# EAGLE design watch030818 (EAGLE 8.3.1)
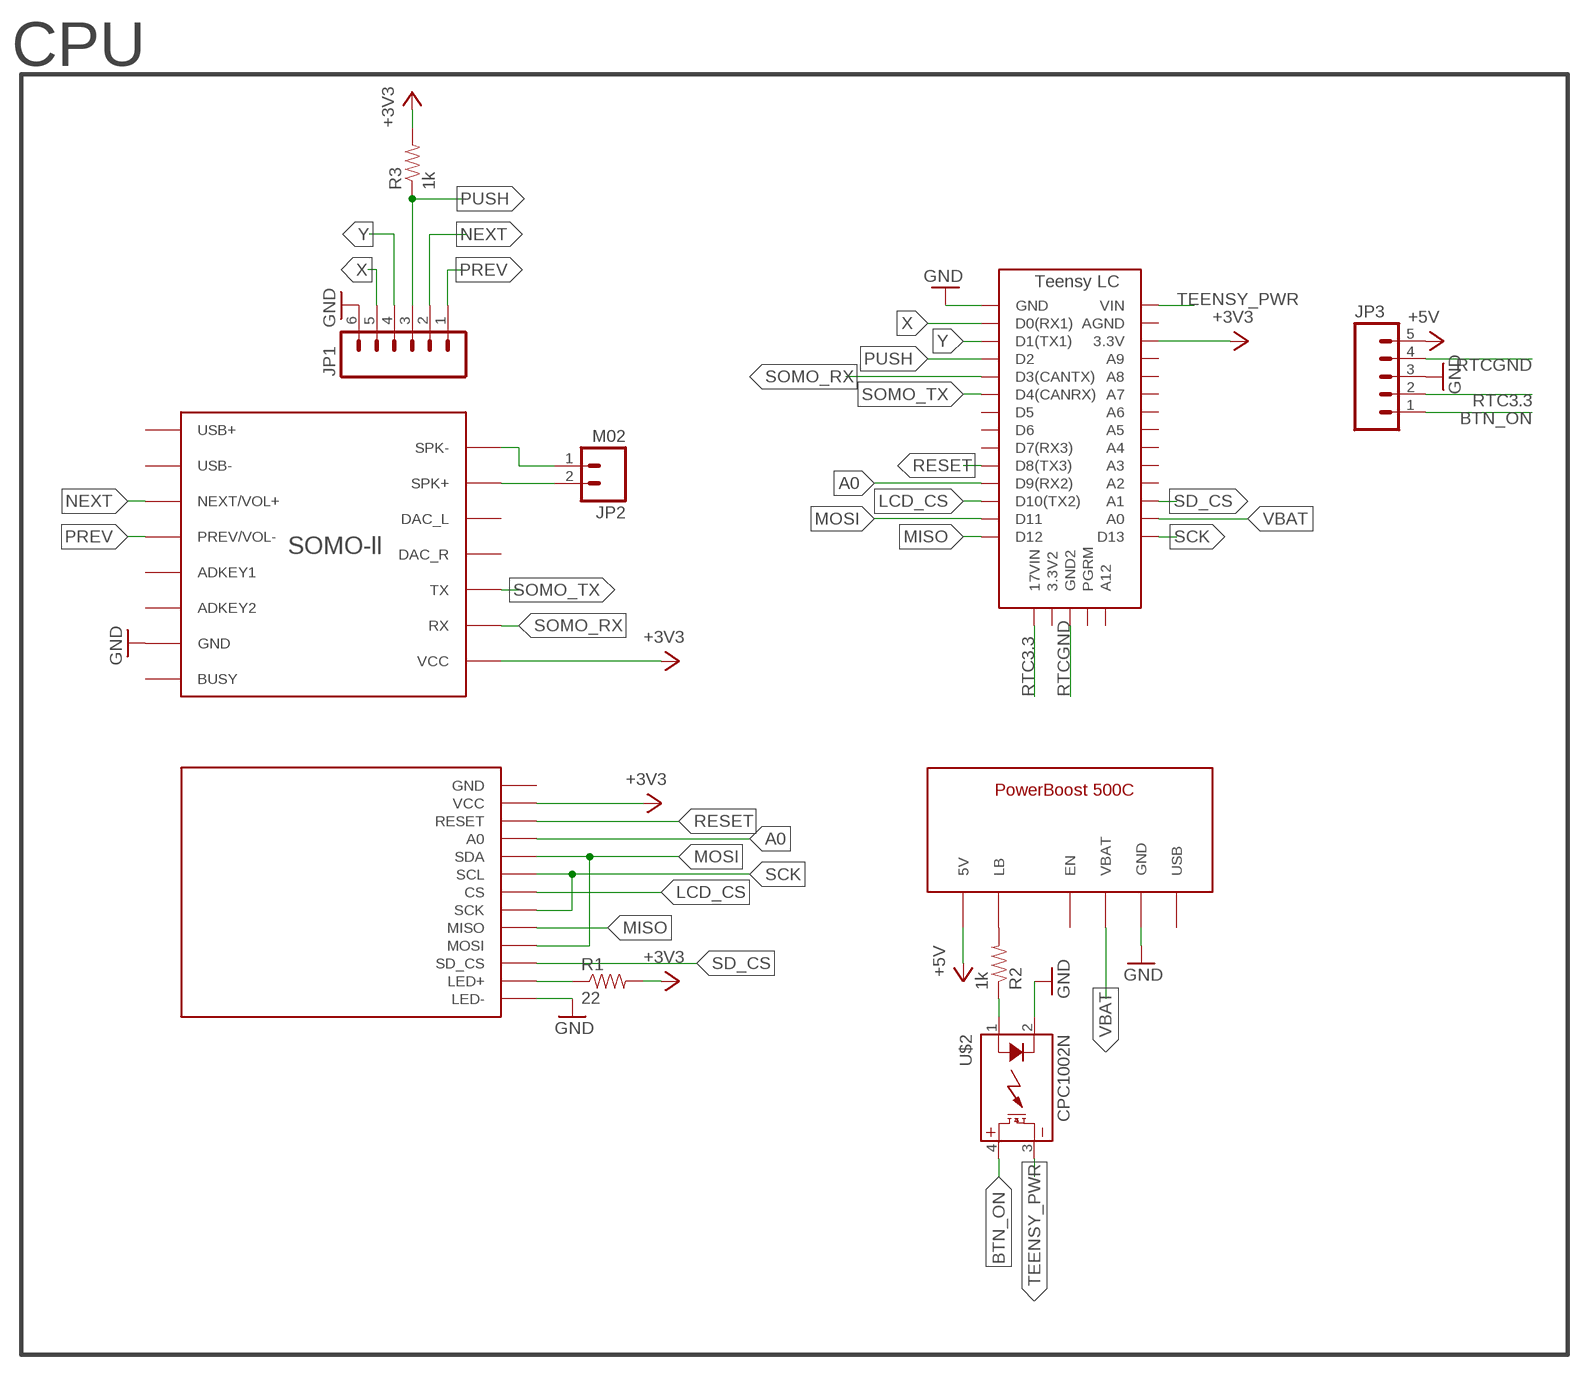
[diagram p0: schematic, sheet 1]

## Parts
1.8-SPI-TFT  KMR-1.8_SPI_TFT  [KMR-1.8_SPI_TFT]
JP1  M06  [1X06]
JP2  M02  [1X02]
JP3  M05  [1X05]
R1  22  RESISTOR0402  [0402-RES]
R2  1k  RESISTOR0402  [0402-RES]
R3  1k  RESISTOR0402  [0402-RES]
U$1  TEENSY_LC  [TEENSY_LC]
U$2  CPC1002N  [SOP04]
U$5  POWERBOOST-500C  [POWERBOOST-500C]
U$11  SOMO-LL  [SOMO-LL]

## Nets
+3V3: 1.8-SPI-TFT.VCC R1.2 R3.2 U$1.3.3V U$11.VCC
+5V: JP3.5 U$5.5V
A0: 1.8-SPI-TFT.A0 U$1.D9(RX2)
BTN_ON: JP3.1 U$2.4(DC+)
GND: 1.8-SPI-TFT.LED- JP1.6 JP3.3 U$1.GND U$2.2(CONTROL-) U$5.GND0(GND) U$5.GND1(GND) U$5.GND2(GND) U$11.GND U$11.GND@0(GND)
LB: R2.2 U$5.LB
LCD_CS: 1.8-SPI-TFT.CS U$1.D10(TX2)
MISO: 1.8-SPI-TFT.MISO U$1.D12
MOSI: 1.8-SPI-TFT.MOSI 1.8-SPI-TFT.SDA U$1.D11
N$1: 1.8-SPI-TFT.LED+ R1.1
N$3: R2.1 U$2.1(CONTROL+)
NEXT: JP1.2 U$11.NEXT/VOL+
PREV: JP1.1 U$11.PREV/VOL-
PUSH: JP1.3 R3.1 U$1.D2
RESET: 1.8-SPI-TFT.RESET U$1.D8(TX3)
RTC3.3: JP3.2 U$1.17VIN
RTCGND: JP3.4 U$1.GND2
SCK: 1.8-SPI-TFT.SCK 1.8-SPI-TFT.SCL U$1.D13
SD_CS: 1.8-SPI-TFT.SD_CS U$1.A1
SOMO_RX: U$1.D3(CANTX) U$11.RX
SOMO_TX: U$1.D4(CANRX) U$11.TX
SPK_IN: JP2.1 U$11.SPK-
SPK_OUT: JP2.2 U$11.SPK+
TEENSY_PWR: U$1.VIN U$2.3(DC-)
VBAT: U$1.A0 U$5.VBAT
X: JP1.5 U$1.D0(RX1)
Y: JP1.4 U$1.D1(TX1)
Unconnected: 1.8-SPI-TFT.GND U$1.3.3V2 U$1.A2 U$1.A3 U$1.A4 U$1.A5 U$1.A6 U$1.A7 U$1.A8 U$1.A9 U$1.A12 U$1.AGND U$1.D5 U$1.D6 U$1.D7(RX3) U$1.PGRM U$5.EN U$5.USB U$11.ADKEY1 U$11.ADKEY2 U$11.BUSY U$11.DAC_L U$11.DAC_R U$11.USB+ U$11.USB-

## Notes on the sheet
- CPU

## Library data of the parts
1.8-SPI-TFT = CH:KMR-1.8_SPI_TFT
JP1 = HyTechDevices:M06: Standard 6-pin 0.1" header. NOTES ON THE VARIANTS LOCK and LOCK_LONGPADS... This footprint was designed to help hold the alignment of a through-hole component (i.e. 6-pin header) while soldering it into place. You may notice that each hole has been shifted either up or down by 0.005 of an inch from it's more standard position (which is a perfectly straight line). This slight alteration caused the pins (the squares in the middle) to touch the edges of the holes. Because they are alternating, it causes a "brace" to hold the component in place. 0.005 has proven to be the perfect amount of "off-center" position when using our standard breakaway headers. Although looks a little odd when you look at the bare footprint, once you have a header in there, the alteration is very hard to notice. Also,if you push a header all the way into place, it is covered up entirely on the bottom side. This idea of altering the position of holes to aid alignment will be further integrated into the Sparkfun Library for other footprints. It can help hold any component with 3 or more connection pins. Note: The Sparkfun version includes many other packages including surface mount that may be of future interest. Source: Sparkfun <https://github.com/sparkfun/SparkFun-Eagle-Libraries>
JP2 = HyTechDevices:M02: Standard 2-pin 0.1" header. NOTES ON THE VARIANTS LOCK and LOCK_LONGPADS... This footprint was designed to help hold the alignment of a through-hole component (i.e. 6-pin header) while soldering it into place. You may notice that each hole has been shifted either up or down by 0.005 of an inch from it's more standard position (which is a perfectly straight line). This slight alteration caused the pins (the squares in the middle) to touch the edges of the holes. Because they are alternating, it causes a "brace" to hold the component in place. 0.005 has proven to be the perfect amount of "off-center" position when using our standard breakaway headers. Although looks a little odd when you look at the bare footprint, once you have a header in there, the alteration is very hard to notice. Also,if you push a header all the way into place, it is covered up entirely on the bottom side. This idea of altering the position of holes to aid alignment will be further integrated into the Sparkfun Library for other footprints. It can help hold any component with 3 or more connection pins. Note: The Sparkfun version includes many other packages including surface mount that may be of future interest. Source: Sparkfun <https://github.com/sparkfun/SparkFun-Eagle-Libraries>
JP3 = HyTechDevices:M05: Standard 5-pin 0.1" header. NOTES ON THE VARIANTS LOCK and LOCK_LONGPADS... This footprint was designed to help hold the alignment of a through-hole component (i.e. 5-pin header) while soldering it into place. You may notice that each hole has been shifted either up or down by 0.005 of an inch from it's more standard position (which is a perfectly straight line). This slight alteration caused the pins (the squares in the middle) to touch the edges of the holes. Because they are alternating, it causes a "brace" to hold the component in place. 0.005 has proven to be the perfect amount of "off-center" position when using our standard breakaway headers. Although looks a little odd when you look at the bare footprint, once you have a header in there, the alteration is very hard to notice. Also,if you push a header all the way into place, it is covered up entirely on the bottom side. This idea of altering the position of holes to aid alignment will be further integrated into the Sparkfun Library for other footprints. It can help hold any component with 3 or more connection pins. Note: The Sparkfun version includes many other packages including surface mount that may be of future interest. Source: Sparkfun <https://github.com/sparkfun/SparkFun-Eagle-Libraries>
R1-R3 = HyTechDevices:RESISTOR: Resistor Basic schematic elements and footprints for 0603, 1206, and PTH resistors.
U$1 = HyTechDevices:TEENSY_LC: Version of the Teensy LC board that uses the 2 main rows of pins and the pins opposite the usb port.
U$2 = HyTechDevices:CPC1002N: IXYS Solid State Relay .7A
U$5 = CH:POWERBOOST-500C
U$11 = CH:SOMO-LL

## Board
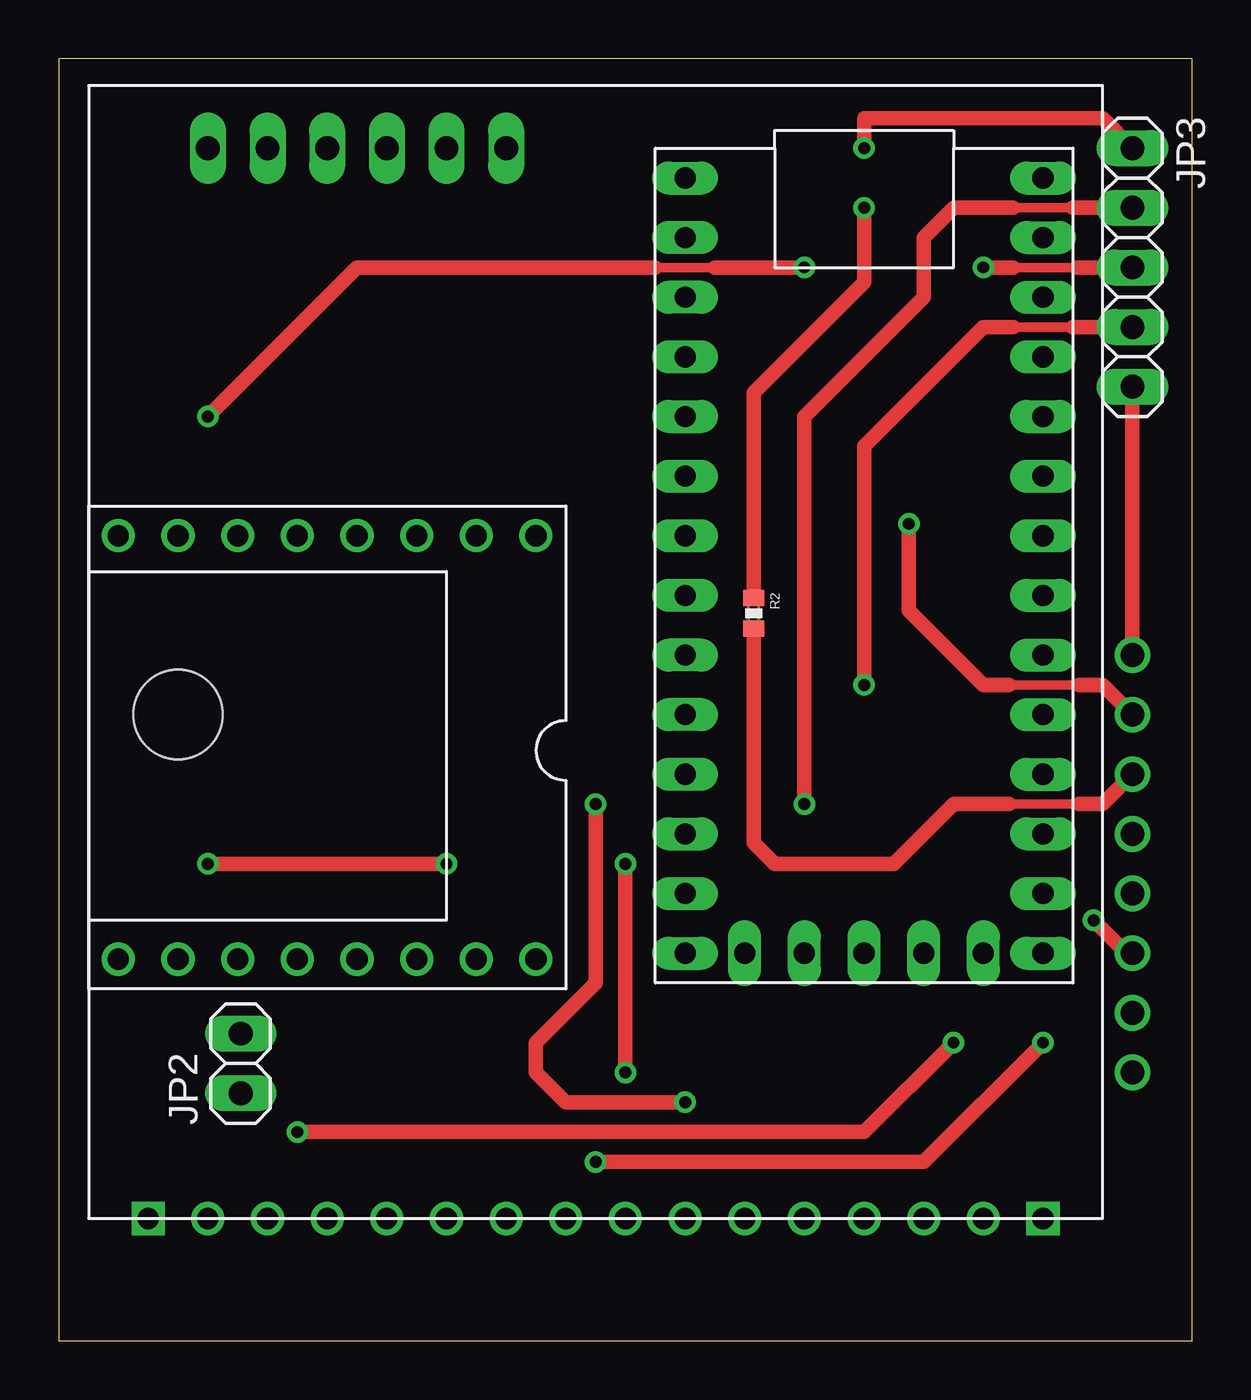
[diagram p1: board, top side]
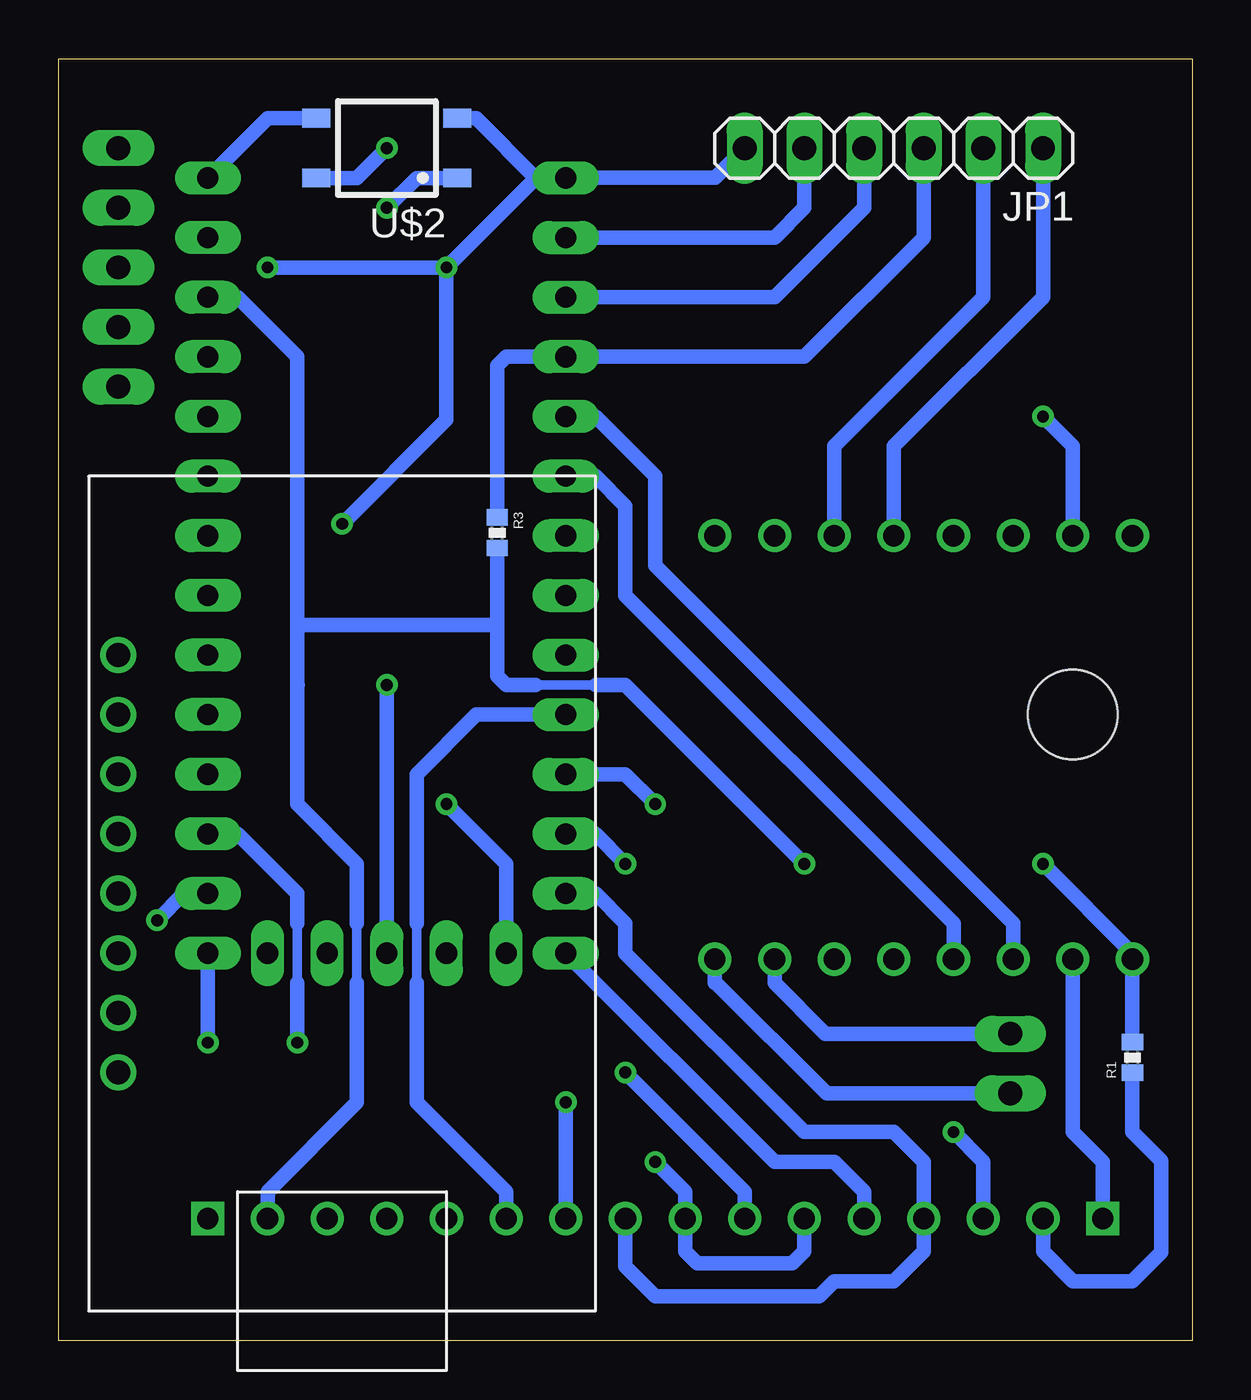
[diagram p2: board, bottom side, seen from below]

Size 48.26 x 54.61 mm. Coordinates in mm from the lower left corner, seen from the top.
Outline: 48.26,0 48.26,54.61 0,54.61 0,0 48.26,0
Copper layers (1*16): Top 0.035mm / dielectric 1.5mm / Bottom 0.035mm
Design rules "DRC Advanced Circuits": minimum track width 6mil, minimum drill 15mil, track to track 6mil, track to pad 6mil, pad to pad 6mil, via to via 6mil, smd to smd 6mil, copper to edge 40mil, drill to drill 6mil, minimum pad ring 10mil, minimum via ring 8mil, stop-mask expansion 4mil, vias tented up to drill 0mil, thermal gap 10mil
Holes 3.81 mm at 5.08,26.67

### Footprints (pad centres in the part's own frame; a part is rotated, then mirrored left to right if it is on the bottom)
KMR-1.8_SPI_TFT = drill 0.9: A0 22.86,0; CS 15.24,0; LED+ 2.54,0; MISO 10.16,0; MOSI 7.62,0; NC1 27.94,0; NC2 30.48,0; NC3 33.02,0; RESET 25.4,0; SCK 12.7,0; SCL 17.78,0; SD_CS 5.08,0; SDA 20.32,0; VCC 35.56,0 | drill 0.9 square: GND 38.1,0; LED- 0,0
1X06 = drill 1.016 long: 1 -6.35,0; 2 -3.81,0; 3 -1.27,0; 4 1.27,0; 5 3.81,0; 6 6.35,0
1X02 = drill 1.016 long: 1 -1.27,0; 2 1.27,0
1X05 = drill 1.016 long: 1 -5.08,0; 2 -2.54,0; 3 0,0; 4 2.54,0; 5 5.08,0
0402-RES = smd 0.7 x 0.9: 1 -0.65,0; 2 0.65,0
TEENSY_LC = drill 0.9 long: 3.3V 16.51,29.21; 3.3V2 6.35,1.27; 17VIN 3.81,1.27; A0 16.51,3.81; A1 16.51,6.35; A2 16.51,8.89; A3 16.51,11.43; A4 16.51,13.97; A5 16.51,16.51; A6 16.51,19.05; A7 16.51,21.59; A8 16.51,24.13; A9 16.51,26.67; A12 13.97,1.27; AGND 16.51,31.75; D0(RX1) 1.27,31.75; D1(TX1) 1.27,29.21; D2 1.27,26.67; D3(CANTX) 1.27,24.13; D4(CANRX) 1.27,21.59; D5 1.27,19.05; D6 1.27,16.51; D7(RX3) 1.27,13.97; D8(TX3) 1.27,11.43; D9(RX2) 1.27,8.89; D10(TX2) 1.27,6.35; D11 1.27,3.81; D12 1.27,1.27; D13 16.51,1.27; GND 1.27,34.29; GND2 8.89,1.27; PGRM 11.43,1.27; VIN 16.51,34.29
SOP04 = smd 0.8 x 1.2: 1 -1.27,-3; 2 1.27,-3; 3 1.27,3; 4 -1.27,3
POWERBOOST-500C = drill 1.016: 5V 7.62,1.27; EN 17.78,1.27; GND0 10.16,1.27; GND1 15.24,1.27; GND2 22.86,1.27; LB 12.7,1.27; USB 25.4,1.27; VBAT 20.32,1.27
SOMO-LL = drill 0.9: ADKEY1 1.27,8.89; ADKEY2 1.27,6.35; BUSY 1.27,1.27; DAC_L 19.304,13.97; DAC_R 19.304,11.43; GND 19.304,3.81; GND@0 1.27,3.81; NEXT/VOL+ 1.27,13.97; PREV/VOL- 1.27,11.43; RX 19.304,6.35; SPK+ 19.304,16.51; SPK- 19.304,19.05; TX 19.304,8.89; USB+ 1.27,19.05; USB- 1.27,16.51; VCC 19.304,1.27

### Placement (x,y rotation side)
1.8-SPI-TFT  3.81,5.21 0 top
JP1  12.7,50.8 180 bottom
JP2  7.75,11.81 90 top
JP3  45.72,45.72 270 top
R1  2.54,12.06 90 bottom
R2  29.59,30.99 270 top
R3  29.59,34.42 270 bottom
U$1  25.4,15.24 0 top
U$2  34.29,50.8 90 bottom
U$5  46.99,36.83 270 bottom
U$11  1.27,35.56 270 top

### Tracks (layer width: path | path; a pad name or v marks a point on that pad's centre or on a via)
+3V3  (via drill 0.51)
  Top 0.61: v16.51,20.32 v6.35,20.32
  Bottom 0.406: 35.56,15.24 35.56,17.78 | 27.94,27.94 25.4,27.94
  Bottom 0.61: U$1.3.3V 40.64,44.45 38.1,41.91 38.1,30.47 | 1.8-SPI-TFT.VCC 39.37,6.35 35.56,10.16 35.56,15.24 | R1.2 U$11.VCC 2.54,16.51 v6.35,20.32 | 35.56,17.78 35.56,20.32 38.1,22.86 38.1,27.95 | 38.09,27.94 38.1,27.95 | 38.1,30.47 38.1,27.95 | 27.94,27.94 29.21,27.94 29.59,28.32 29.59,30.48 | R3.2 29.59,30.48 | 29.59,30.48 38.09,30.48 38.1,30.47 | 25.4,27.94 24.13,27.94 v16.51,20.32
+5V
  Top 0.61: JP3.5 U$5.5V
A0  (via drill 0.51)
  Top 0.61: v22.86,22.86 22.86,15.24 20.32,12.7 20.32,11.43 21.59,10.16 v26.67,10.16
  Bottom 0.61: U$1.D9(RX2) 24.13,24.13 v22.86,22.86 | v26.67,10.16 1.8-SPI-TFT.A0
BTN_ON  (via drill 0.51)
  Top 0.61: JP3.1 44.45,52.07 34.29,52.07 v34.29,50.8
  Bottom 0.61: U$2.4 35.56,49.53 v34.29,50.8
GND  (via drill 0.51)
  Top 0.406: 40.48,27.94 43.43,27.94 | 43.34,45.72 40.64,45.72 | 25.4,45.72 27.94,45.72
  Top 0.61: 40.48,27.94 39.37,27.94 36.2,31.11 v36.2,34.8 | 43.43,27.94 44.45,27.94 U$5.GND0 | JP3.3 43.34,45.72 | v6.35,39.37 12.7,45.72 25.4,45.72 | v31.75,45.72 27.94,45.72 | 40.64,45.72 v39.37,45.72
  Bottom 0.61: U$11.GND@0 5.08,38.1 v6.35,39.37 | U$11.GND 5.08,8.89 3.81,7.62 1.8-SPI-TFT.LED- | 27.94,49.53 U$1.GND 20.31,49.54 JP1.6 | 27.94,49.53 v31.75,45.72 | v36.2,34.8 31.75,39.24 v31.75,45.72 | v31.75,45.72 v39.37,45.72 | U$2.2 30.48,52.07 27.94,49.53
LB
  Top 0.406: 40.48,22.86 43.43,22.86
  Top 0.61: 40.48,22.86 38.1,22.86 35.56,20.32 30.48,20.32 29.59,21.21 | 43.43,22.86 44.45,22.86 U$5.LB | R2.2 29.59,21.59 | 29.59,21.59 29.59,21.21 | 29.59,21.59 29.59,21.21
LCD_CS  (via drill 0.51)
  Top 0.61: v24.13,20.32 v24.13,11.43
  Bottom 0.61: 1.8-SPI-TFT.CS 19.05,6.35 v24.13,11.43 | U$1.D10(TX2) 25.4,21.59 v24.13,20.32
MISO
  Bottom 0.61: 1.8-SPI-TFT.MISO 13.97,6.35 15.24,7.62 17.78,7.62 U$1.D12
MOSI
  Bottom 0.61: 1.8-SPI-TFT.SDA 24.13,3.17 22.86,1.91 15.88,1.91 15.24,2.54 12.7,2.54 11.43,3.81 1.8-SPI-TFT.MOSI 11.43,7.62 12.7,8.89 16.51,8.89 24.13,16.51 24.13,17.78 25.4,19.05 U$1.D11
N$1
  Bottom 0.61: R1.1 2.54,8.89 1.32,7.67 1.32,3.76 2.54,2.54 5.08,2.54 6.35,3.81 1.8-SPI-TFT.LED+
N$3  (via drill 0.51)
  Top 0.61: R2.1 29.59,40.39 34.29,45.09 v34.29,48.26
  Bottom 0.61: U$2.1 33.02,49.53 v34.29,48.26
NEXT
  Bottom 0.61: U$11.NEXT/VOL+ 15.24,38.1 8.89,44.45 JP1.2
PREV
  Bottom 0.61: U$11.PREV/VOL- 12.7,38.1 6.35,44.45 JP1.1
PUSH
  Bottom 0.61: R3.1 29.59,41.53 29.21,41.91 U$1.D2 16.51,41.91 11.43,46.99 JP1.3
RESET
  Bottom 0.406: 33.02,17.78 33.02,15.24
  Bottom 0.61: 33.02,15.24 33.02,10.16 29.21,6.35 1.8-SPI-TFT.RESET | 33.02,17.78 33.02,24.13 30.48,26.67 U$1.D8(TX3)
RTC3.3  (via drill 0.51)
  Top 0.406: 43.18,48.26 40.64,48.26
  Top 0.61: JP3.2 43.18,48.26 | 40.64,48.26 38.1,48.26 36.83,46.99 36.83,44.45 31.75,39.37 v31.75,22.86
  Bottom 0.61: v31.75,22.86 29.21,20.32 U$1.17VIN
RTCGND  (via drill 0.51)
  Top 0.406: 43.18,43.18 40.64,43.18
  Top 0.61: JP3.4 43.18,43.18 | 40.64,43.18 39.37,43.18 34.29,38.1 v34.29,27.94
  Bottom 0.61: U$1.GND2 v34.29,27.94
SCK  (via drill 0.51)
  Top 0.61: v41.91,12.7 36.83,7.62 v22.86,7.62
  Bottom 0.61: 1.8-SPI-TFT.SCK 16.51,3.81 17.02,3.3 21.08,3.3 21.59,3.81 1.8-SPI-TFT.SCL 21.59,6.35 v22.86,7.62 | U$1.D13 v41.91,12.7
SD_CS  (via drill 0.51)
  Top 0.61: v10.16,8.89 34.29,8.89 v38.1,12.7
  Bottom 0.406: 38.1,17.78 38.1,15.24
  Bottom 0.61: 1.8-SPI-TFT.SD_CS 8.89,7.62 v10.16,8.89 | v38.1,12.7 38.1,15.24 | U$1.A1 40.64,21.59 38.1,19.05 38.1,17.78
SOMO_RX
  Bottom 0.61: U$1.D3(CANTX) 25.4,39.37 22.86,36.83 22.86,33.02 7.62,17.78 U$11.RX
SOMO_TX
  Bottom 0.61: U$11.TX 10.16,17.78 24.13,31.75 24.13,35.56 25.4,36.83 U$1.D4(CANRX)
SPK_IN
  Bottom 0.61: 20.32,15.29 U$11.SPK- | 20.32,15.29 20.32,15.24 | JP2.1 15.57,10.54 20.32,15.29
SPK_OUT
  Bottom 0.61: U$11.SPK+ 17.78,15.24 15.62,13.08 JP2.2
TEENSY_PWR
  Bottom 0.61: U$2.3 39.37,52.07 U$1.VIN
VBAT  (via drill 0.51)
  Top 0.61: v44.07,17.91 45.47,16.51 U$5.VBAT
  Bottom 0.61: U$1.A0 42.93,19.05 v44.07,17.91
X
  Bottom 0.61: U$1.D0(RX1) 22.86,46.99 | 22.86,46.99 21.59,46.99 | 22.86,46.99 17.78,46.99 16.51,48.26 JP1.5
Y
  Bottom 0.61: 21.91,44.45 21.59,44.45 | 21.91,44.45 U$1.D1(TX1) | JP1.4 13.97,48.26 17.78,44.45 21.91,44.45